# Altium schematic sheet Controller.SchDoc: Set in Document Options » Parameters » Title
size Tabloid; Author: Set in Document Options » Parameters » Author + Contact info
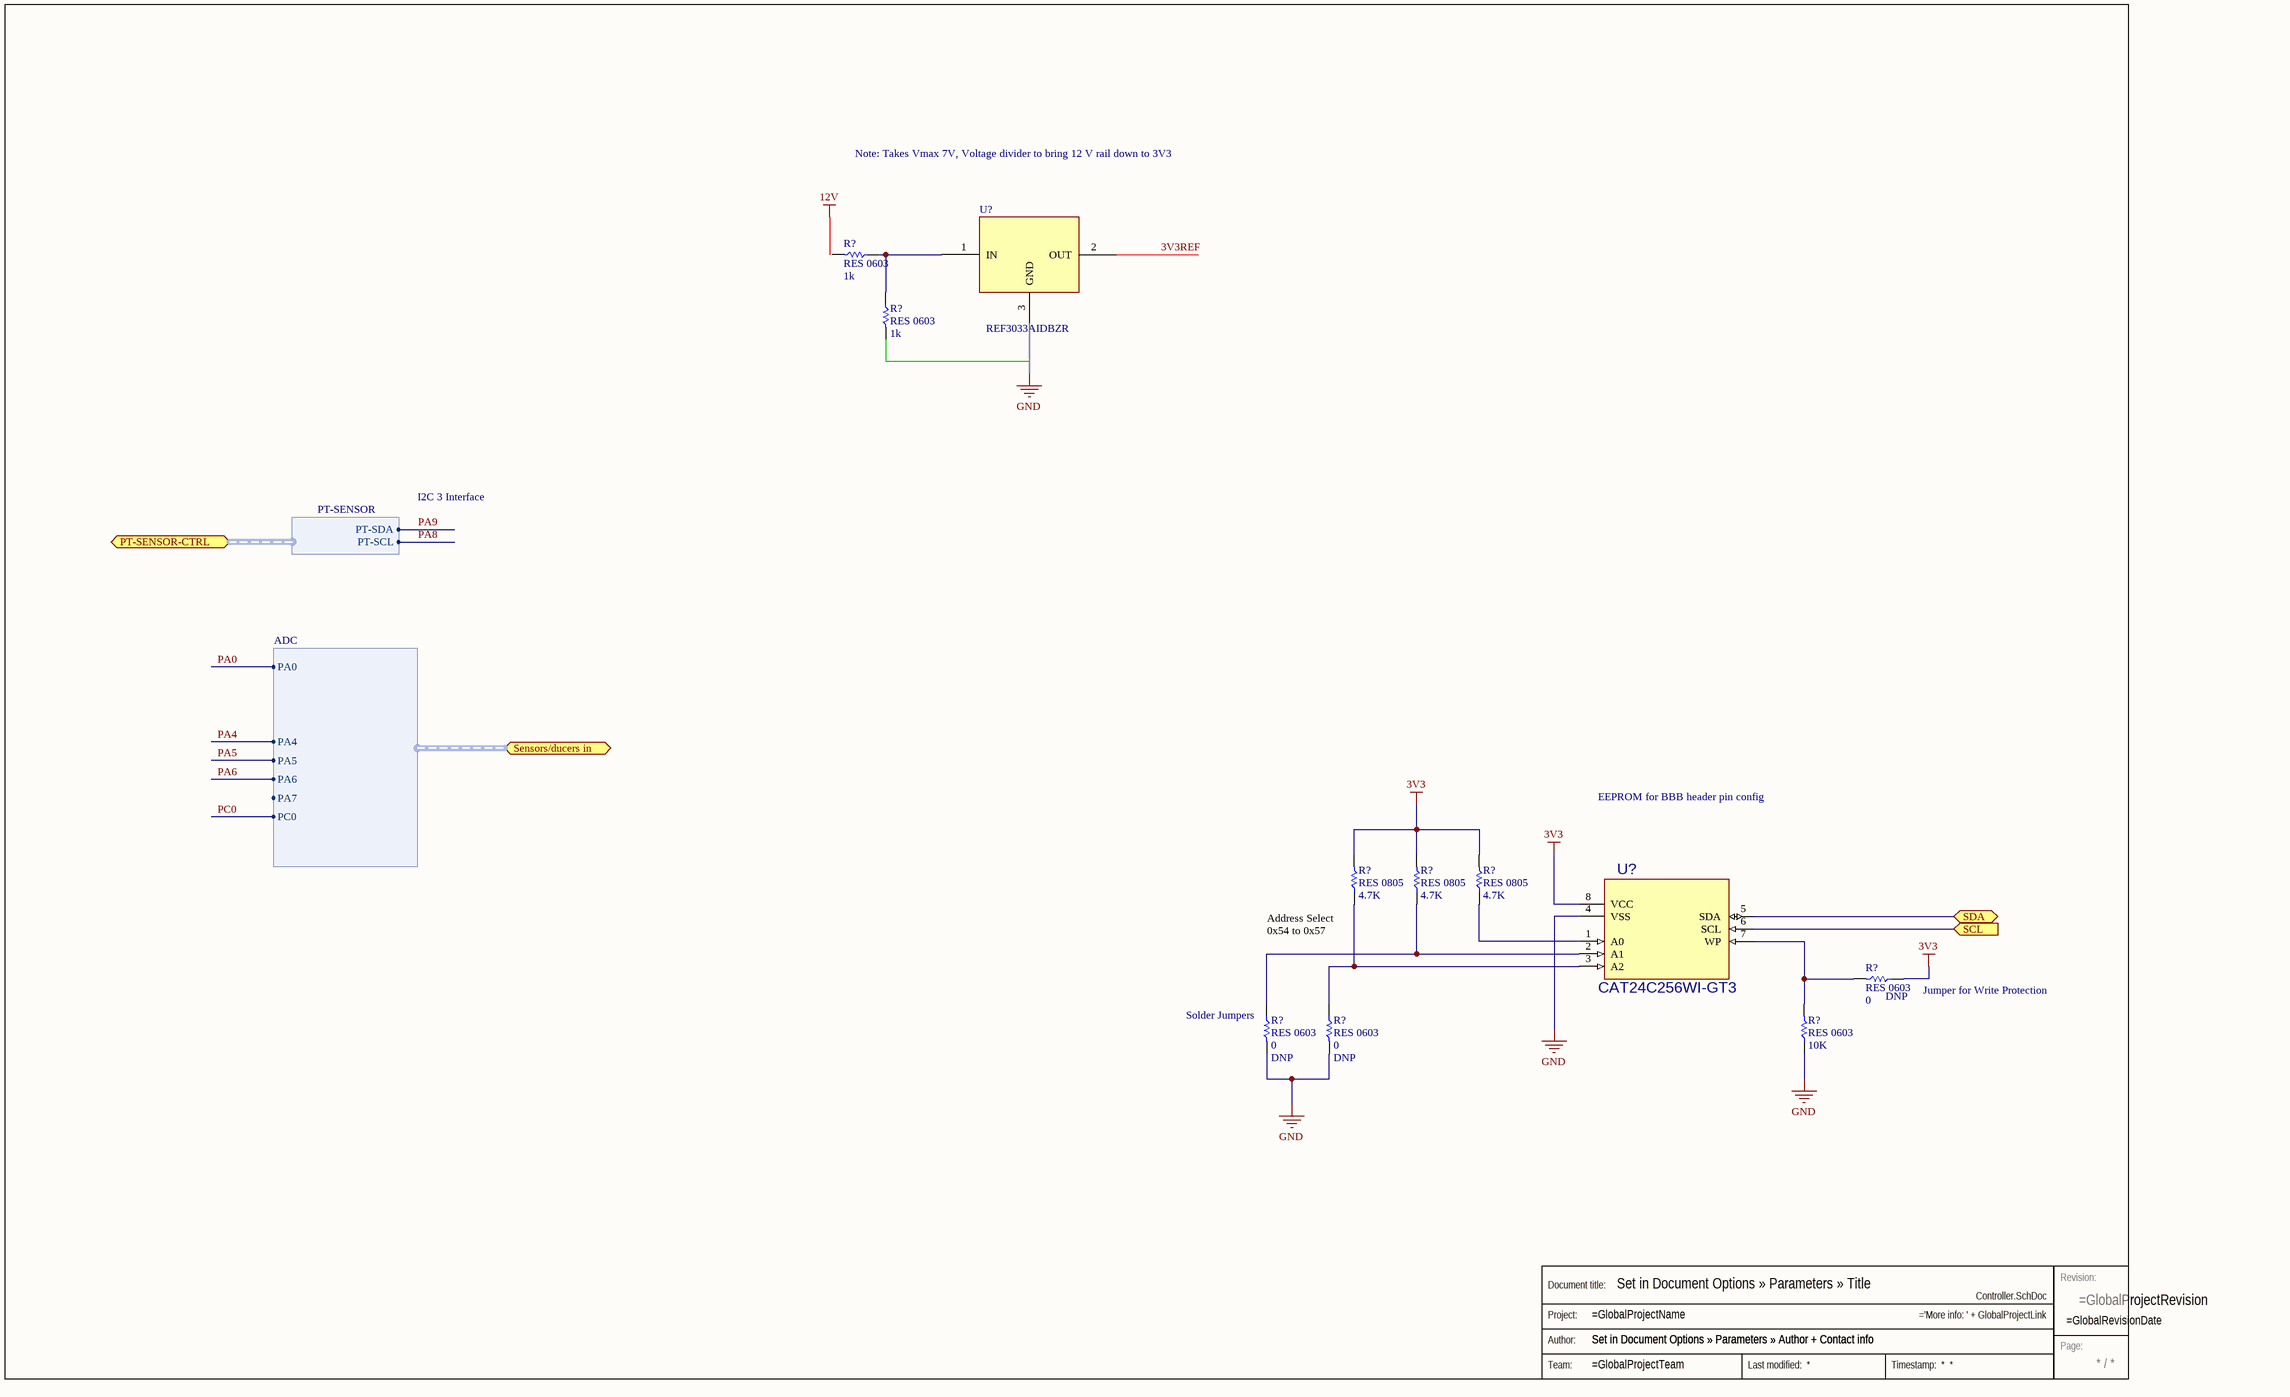
[diagram p0: Controller.SchDoc]

## Parts
(Parts that share a designator on the sheet are numbered #1, #2 ... from top to bottom, then left to right.)
R?#1  RES 0603  Value (Ohms): 1k  [RES 0603]
R?#2  RES 0603  Value (Ohms): 1k  [RES 0603]
R?#3  RES 0805  Value (Ohms): 4.7K  [RES 0805]
R?#4  RES 0805  Value (Ohms): 4.7K  [RES 0805]
R?#5  RES 0805  Value (Ohms): 4.7K  [RES 0805]
R?#6  RES 0603  Value (Ohms): 0  Do Not Place: DNP  [RES 0603]
R?#7  RES 0603  Value (Ohms): 10K  [RES 0603]
R?#8  RES 0603  Value (Ohms): 0  Do Not Place: DNP  [RES 0603]
R?#9  RES 0603  Value (Ohms): 0  Do Not Place: DNP  [RES 0603]
Stamp  Stamp  (value not drawn)  (graphical)
U?#1  REF3033AIDBZR  [SOT95P282X145-3N]
U?#2  CAT24C256WI-GT3  [SOIC127P600X175-8N]

## Ports
PT-SENSOR-CTRL (harness PT-SENSOR), SCL (in), SDA (bidir), Sensors/ducers in (harness ADC)

## Harnesses
PT-SENSOR: PT-SCL, PT-SDA
ADC: PA0, PA4, PA5, PA6, PA7, PC0

## Nets
3V3: R?#3.1 R?#4.1 R?#5.1 R?#6.2 U?#2.8(VCC)
GND: R?#7.2 R?#8.1 R?#9.1 U?#2.4(VSS)
PA0: port Sensors/ducers in.PA0
PA4: port Sensors/ducers in.PA4
PA5: port Sensors/ducers in.PA5
PA6: port Sensors/ducers in.PA6
PA8: port PT-SENSOR-CTRL.PT-SCL
PA9: port PT-SENSOR-CTRL.PT-SDA
PC0: port Sensors/ducers in.PC0
SCL: U?#2.6(SCL) ; port SCL
SDA: U?#2.5(SDA) ; port SDA
NetR?#1_2: R?#1.2 R?#2.2 U?#1.1(IN)
NetR?#3_2: R?#3.2 R?#9.2 U?#2.3(A2)
NetR?#4_2: R?#4.2 R?#8.2 U?#2.2(A1)
NetR?#5_2: R?#5.2 U?#2.1(A0)
NetR?#6_1: R?#6.1 R?#7.1 U?#2.7(WP)

Not connected (* = marked no-connect by the designer): R?#1 1; R?#2 1; U?#1 2(OUT) 3(GND)

## Buses and harness runs
bus 3V3REF

## Notes on the sheet
- Note: Takes Vmax 7V, Voltage divider to bring 12 V rail down to 3V3
- I2C 3 Interface
- EEPROM for BBB header pin config
- (near R?#3) Address Select
  0x54 to 0x57
- (near R?#8) Solder Jumpers
- (near R?#6) Jumper for Write Protection
- Labels drawn without touching a wire or pin: 12V, GND
- (in symbol Stamp) Revision:; Document title:; Project:; Author:; Page:; Team:

## Library data of the parts
U?#1 = REF3033AIDBZR: Manufacturer: Texas Instrument; Digikey Link: https://www.digikey.com/product-detail/en/texas-instruments/REF3033AIDBZR/296-26324-1-ND/2254967; Digikey P/N: 296-26324-1-ND; Manufacturer P/N: REF3033AIDBZR
U?#2 = CAT24C256WI-GT3: CAT24C256 Series 256 kbit %2832 K x 8%29 1.8 V I2C CMOS Serial EEPROM - SOIC-8; MF: ON Semiconductor; MP: CAT24C256WI-GT3; Price: 0.32 USD; Package: SOIC-8 ON Semiconductor; Availability: Good; Value: *; Mouser: http://www.mouser.com/ProductDetail/ON-Semiconductor/CAT24C256WI-GT3/?qs=sGAEpiMZZMuVhdAcoizlReWCLrywymY2%2fLYsR6sjnIQ%3d
R?#1 R?#2 R?#6-R?#9 = RES 0603: PartNumber: *; Tolerance: *
R?#3-R?#5 = RES 0805: PartNumber: *; Tolerance: *